# Altium project VEX Spin Up.PrjPcb
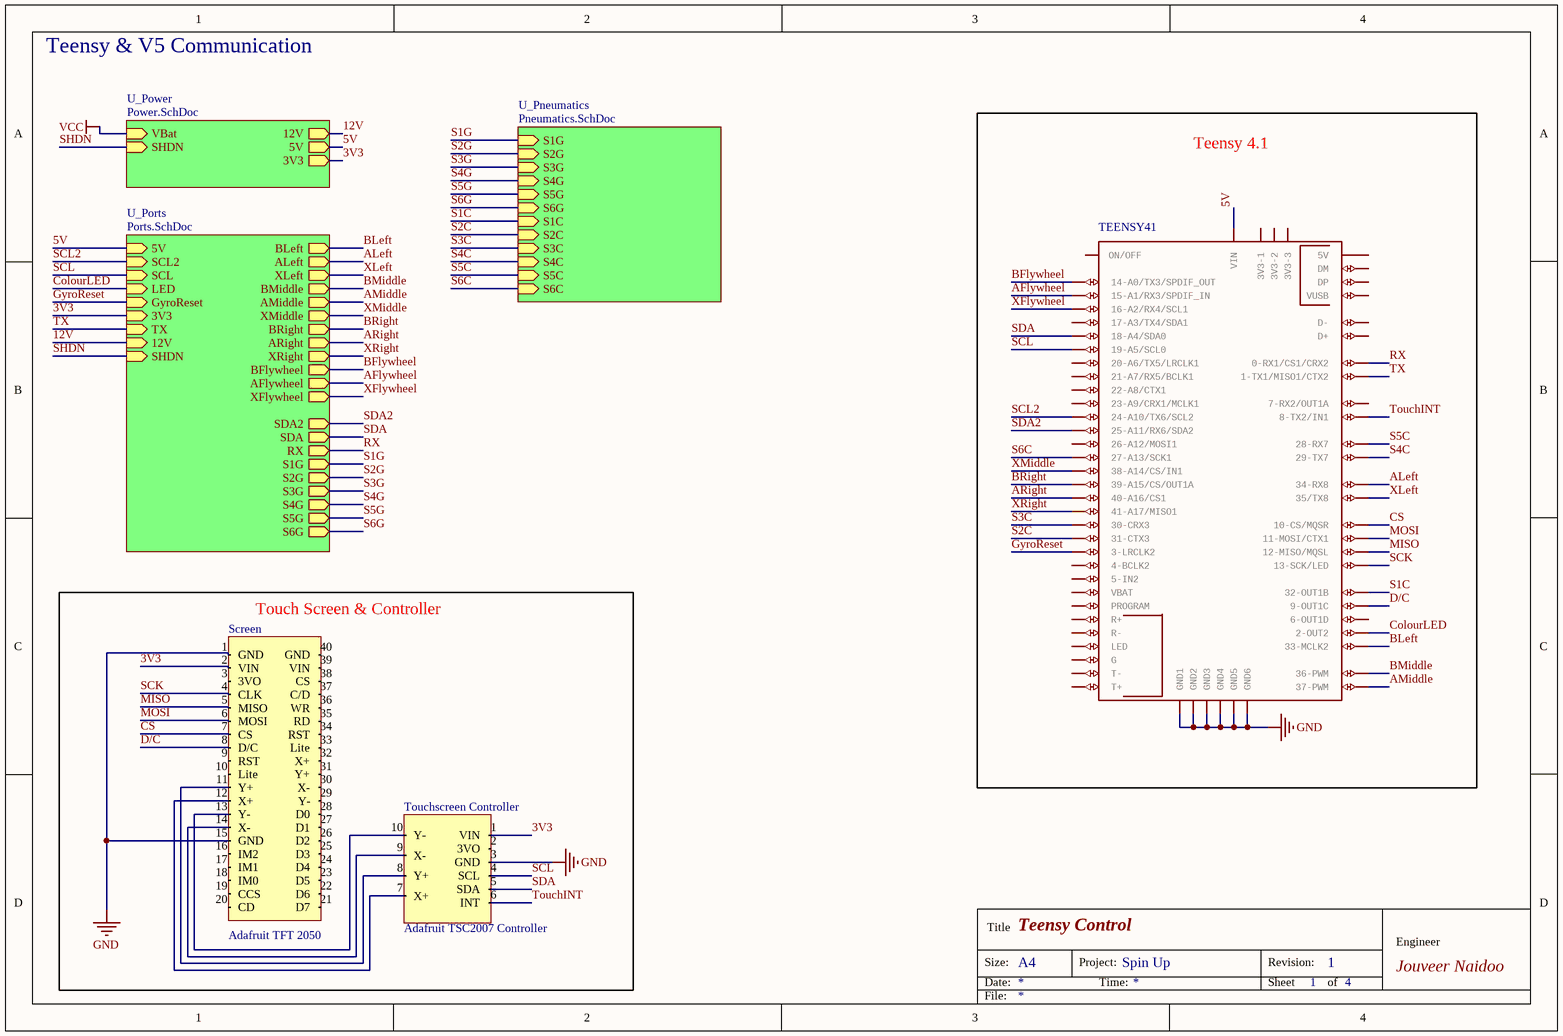
[diagram p0: Teensy Brain Control.SchDoc]
Engineer: Jouveer Naidoo; ProjectIdentifier: Spin Up
4 sheets, 82 parts. Net scope: hierarchical (ports join the sheet entries above them; power ports are global).
Board file: TeensyBrain.PcbDoc
Sheets:
  Teensy Brain Control.SchDoc
    U_Pneumatics = Pneumatics.SchDoc
    U_Ports = Ports.SchDoc
    U_Power = Power.SchDoc

## Sheet Teensy Brain Control.SchDoc: Teensy Control
size A4; Engineer: Jouveer Naidoo; DocumentNumber: 3; Revision: 1; SheetNumber: 1; SheetTotal: 4; ProjectIdentifier: Spin Up; SPICEModelCacheFPWZJBEA: <root> / <DocumentId>FPWZJBEA</DocumentId> / </root>

### Parts
Screen  Adafruit TFT 2050  [Adafruit TFT 2050-Footprint-1]
Teensy_4.1  TEENSY41  [TEENSY41]
Touchscreen_Controller  Adafruit TSC2007 Controller  [Adafruit TSC2007 Controller-Footprint-1]

### Blocks framed on the sheet
Teensy 4.1: Teensy_4.1
Touch Screen & Controller: Screen Touchscreen_Controller

### Sub-sheets
U_Pneumatics = Pneumatics.SchDoc: S1G (in), S2G (in), S3G (in), S4G (in), S5G (in), S1C (in), S2C (in), S3C (in), S4C (in), S5C (in), S6G (in), S6C (in)
U_Ports = Ports.SchDoc: 5V (in), BLeft (out), ALeft (out), XLeft (out), BMiddle (out), AMiddle (out), XMiddle (out), BRight (out), ARight (out), XRight (out), SCL (in), SDA (out), LED (in), GyroReset (in), 3V3 (in), TX (in), RX (out), 12V (in), S1G (out), S2G (out), S3G (out), S4G (out), S5G (out), S6G (out), BFlywheel (out), AFlywheel (out), XFlywheel (out), SHDN (in), SCL2 (in), SDA2 (out)
U_Power = Power.SchDoc: 12V (out), 5V (out), VBat (in), SHDN (in), 3V3 (out)

### Nets
GND: Screen.1(GND) Screen.15(GND) Teensy_4.1.GND1 Teensy_4.1.GND2 Teensy_4.1.GND3 Teensy_4.1.GND4 Teensy_4.1.GND5 Teensy_4.1.GND6 Touchscreen_Controller.3(GND)
3V3: Screen.2(VIN) Touchscreen_Controller.1(VIN) ; sheet U_Ports/3V3, sheet U_Power/3V3
5V: Teensy_4.1.VIN ; sheet U_Ports/5V, sheet U_Power/5V
12V: sheet U_Ports/12V, sheet U_Power/12V
AFlywheel: Teensy_4.1.15-A1/RX3/SPDIF_IN ; sheet U_Ports/AFlywheel
ALeft: Teensy_4.1.34-RX8 ; sheet U_Ports/ALeft
AMiddle: Teensy_4.1.37-PWM ; sheet U_Ports/AMiddle
ARight: Teensy_4.1.40-A16/CS1 ; sheet U_Ports/ARight
BFlywheel: Teensy_4.1.14-A0/TX3/SPDIF_OUT ; sheet U_Ports/BFlywheel
BLeft: Teensy_4.1.33-MCLK2 ; sheet U_Ports/BLeft
BMiddle: Teensy_4.1.36-PWM ; sheet U_Ports/BMiddle
BRight: Teensy_4.1.39-A15/CS/OUT1A ; sheet U_Ports/BRight
ColourLED: Teensy_4.1.2-OUT2 ; sheet U_Ports/LED
CS: Screen.7(CS) Teensy_4.1.10-CS\MQSR(10-CS/MQSR)
D/C: Screen.8(D/C) Teensy_4.1.9-OUT1C
GyroReset: Teensy_4.1.3-LRCLK2 ; sheet U_Ports/GyroReset
MISO: Screen.5(MISO) Teensy_4.1.12-MISO/MQSL
MOSI: Screen.6(MOSI) Teensy_4.1.11-MOSI/CTX1
RX: Teensy_4.1.0-RX1/CS1/CRX2 ; sheet U_Ports/RX
S1C: Teensy_4.1.32-OUT1B ; sheet U_Pneumatics/S1C
S1G: sheet U_Pneumatics/S1G, sheet U_Ports/S1G
S2C: Teensy_4.1.31-CTX3 ; sheet U_Pneumatics/S2C
S2G: sheet U_Pneumatics/S2G, sheet U_Ports/S2G
S3C: Teensy_4.1.30-CRX3 ; sheet U_Pneumatics/S3C
S3G: sheet U_Pneumatics/S3G, sheet U_Ports/S3G
S4C: Teensy_4.1.29-TX7 ; sheet U_Pneumatics/S4C
S4G: sheet U_Pneumatics/S4G, sheet U_Ports/S4G
S5C: Teensy_4.1.28-RX7 ; sheet U_Pneumatics/S5C
S5G: sheet U_Pneumatics/S5G, sheet U_Ports/S5G
S6C: Teensy_4.1.27-A13/SCK1 ; sheet U_Pneumatics/S6C
S6G: sheet U_Pneumatics/S6G, sheet U_Ports/S6G
SCK: Screen.4(CLK) Teensy_4.1.13-SCK/LED
SCL: Teensy_4.1.19-A5/SCL0 Touchscreen_Controller.4(SCL) ; sheet U_Ports/SCL
SCL2: Teensy_4.1.24-A10/TX6/SCL2 ; sheet U_Ports/SCL2
SDA: Teensy_4.1.18-A4/SDA0 Touchscreen_Controller.5(SDA) ; sheet U_Ports/SDA
SDA2: Teensy_4.1.25-A11/RX6/SDA2 ; sheet U_Ports/SDA2
SHDN: sheet U_Ports/SHDN, sheet U_Power/SHDN
TouchINT: Teensy_4.1.8-TX2/IN1 Touchscreen_Controller.6(INT)
TX: Teensy_4.1.1-TX1/MISO1/CTX2 ; sheet U_Ports/TX
XFlywheel: Teensy_4.1.16-A2/RX4/SCL1 ; sheet U_Ports/XFlywheel
XLeft: Teensy_4.1.35-TX8(35/TX8) ; sheet U_Ports/XLeft
XMiddle: Teensy_4.1.38-A14/CS/IN1 ; sheet U_Ports/XMiddle
XRight: Teensy_4.1.41-A17/MISO1 ; sheet U_Ports/XRight
NetScreen_11: Screen.11(Y+) Touchscreen_Controller.8(Y+)
NetScreen_12: Screen.12(X+) Touchscreen_Controller.7(X+)
NetScreen_13: Screen.13(Y-) Touchscreen_Controller.10(Y-)
NetScreen_14: Screen.14(X-) Touchscreen_Controller.9(X-)

Not connected (* = marked no-connect by the designer): Screen 3(3VO) 9(RST) 10(Lite) 16(IM2) 17(IM1) 18(IM0) 19(CCS) 20(CD) 21(D7) 22(D6) 23(D5) 24(D4) 25(D3) 26(D2) 27(D1) 28(D0) 29(Y-) 30(X-) 31(Y+) 32(X+) 33(Lite) 34(RST) 35(RD) 36(WR) 37(C/D) 38(CS) 39(VIN) 40(GND); Teensy_4.1 3V3-1 3V3-2 3V3-3 4-BCLK2 5-IN2 6-OUT1D 7-RX2/OUT1A 17-A3/TX4/SDA1 20-A6/TX5/LRCLK1 21-A7/RX5/BCLK1 22-A8/CTX1 23-A9/CRX1/MCLK1 26-A12/MOSI1 +5V(5V) D+ D- DM DP G LED ON/OFF PROGRAM R+ R- T+ T- VBAT VUSB; Touchscreen_Controller 2(3VO)

### Notes on the sheet
- Teensy & V5 Communication
- Size:
- Date:
- Title
- A4
- Project:
- Time:
- Revision:
- Sheet
- of
- Engineer
- File:

### Library data of the parts
Screen = CMP-001-0000-2
Teensy_4.1 = CMP-013-000002-2: Teensy 4.1 Development Board; GateName_1: G$1; Evaluation Kit: Yes; Core Architecture: ARM; DeviceSetName: TEENSY41; Design Item ID: TEENSY41; Source: teensy.SCHLIB; SymbolName_1: TEENSY41; LibraryName: teensy; Package: TEENSY41; Series: i.MX
Touchscreen_Controller = CMP-015-00009-3

## Sheet Pneumatics.SchDoc: Solenoid Drivers
size A4; DocumentNumber: 1; Revision: 1; SheetNumber: 2; SheetTotal: 5
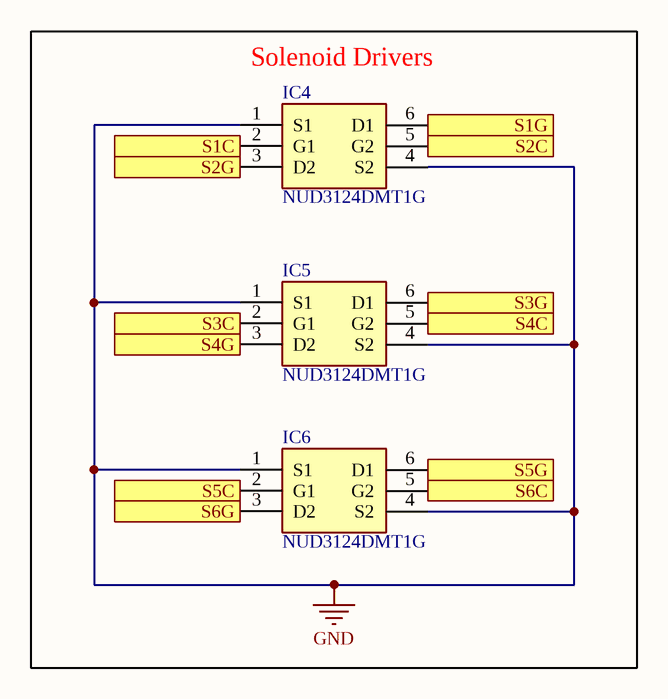
[diagram p1: Pneumatics.SchDoc]

### Parts
IC4  NUD3124DMT1G  [SOT95P275X110-6N]
IC5  NUD3124DMT1G  [SOT95P275X110-6N]
IC6  NUD3124DMT1G  [SOT95P275X110-6N]

### Blocks framed on the sheet
Solenoid Drivers: IC4-IC6

### Ports
S1C (in), S1G (in), S2C (in), S2G (in), S3C (in), S3G (in), S4C (in), S4G (in), S5C (in), S5G (in), S6C (in), S6G (in)

### Nets
GND: IC4.1(S1) IC4.4(S2) IC5.1(S1) IC5.4(S2) IC6.1(S1) IC6.4(S2)
S1C: IC4.2(G1) ; port S1C
S1G: IC4.6(D1) ; port S1G
S2C: IC4.5(G2) ; port S2C
S2G: IC4.3(D2) ; port S2G
S3C: IC5.2(G1) ; port S3C
S3G: IC5.6(D1) ; port S3G
S4C: IC5.5(G2) ; port S4C
S4G: IC5.3(D2) ; port S4G
S5C: IC6.2(G1) ; port S5C
S5G: IC6.6(D1) ; port S5G
S6C: IC6.5(G2) ; port S6C
S6G: IC6.3(D2) ; port S6G

### Notes on the sheet
- Size:
- Date:
- Title
- A4
- Project:
- Time:
- Revision:
- Sheet
- of
- Engineer
- File:

### Library data of the parts
IC4-IC6 = NUD3124DMT1G: Integrated Circuit; Manufacturer_Name: onsemi; Datasheet Link: http://www.onsemi.com/pub/Collateral/NUD3124-D.PDF; Height: 1.1mm; Manufacturer_Part_Number: NUD3124DMT1G; Mouser Part Number: 863-NUD3124DMT1G; Mouser Price/Stock: https://www.mouser.co.uk/ProductDetail/onsemi/NUD3124DMT1G?qs=ZXBb0xZ9WeDtXMbpPTBW4g%3D%3D; Arrow Part Number: NUD3124DMT1G; Arrow Price/Stock: https://www.arrow.com/en/products/nud3124dmt1g/on-semiconductor?region=nac

## Sheet Ports.SchDoc: External Ports
size A4; Engineer: Jouveer Naidoo; DocumentNumber: 2; Revision: 1; SheetNumber: 3; SheetTotal: 4; ProjectIdentifier: Spin Up
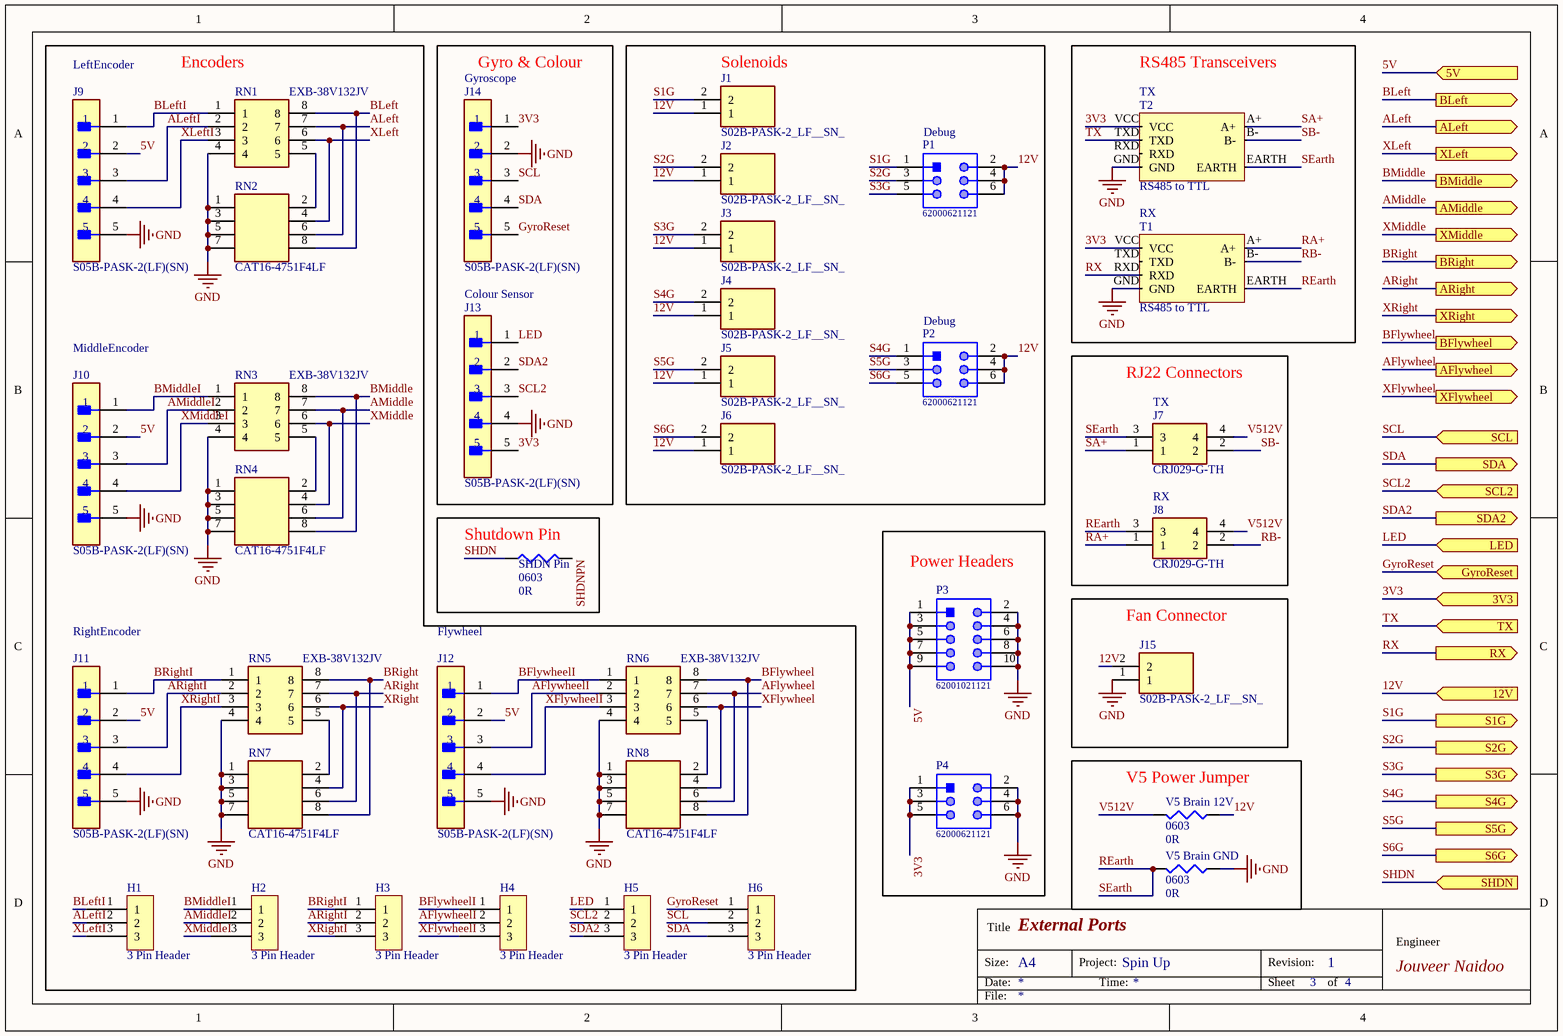
[diagram p2: Ports.SchDoc]

### Parts
H1  3 Pin Header  [3 Pin Header-Footprint-1]
H2  3 Pin Header  [3 Pin Header-Footprint-1]
H3  3 Pin Header  [3 Pin Header-Footprint-1]
H4  3 Pin Header  [3 Pin Header-Footprint-1]
H5  3 Pin Header  [3 Pin Header-Footprint-1]
H6  3 Pin Header  [3 Pin Header-Footprint-1]
J1  S02B-PASK-2_LF__SN_  [S02BPASK2LFSN]
J2  S02B-PASK-2_LF__SN_  [S02BPASK2LFSN]
J3  S02B-PASK-2_LF__SN_  [S02BPASK2LFSN]
J4  S02B-PASK-2_LF__SN_  [S02BPASK2LFSN]
J5  S02B-PASK-2_LF__SN_  [S02BPASK2LFSN]
J6  S02B-PASK-2_LF__SN_  [S02BPASK2LFSN]
J7  CRJ029-G-TH  [CRJ029GTH]
J8  CRJ029-G-TH  [CRJ029GTH]
J9  S05B-PASK-2(LF)(SN)  [FP-S05B-PASK-2_LF_SN-MFG]
J10  S05B-PASK-2(LF)(SN)  [FP-S05B-PASK-2_LF_SN-MFG]
J11  S05B-PASK-2(LF)(SN)  [FP-S05B-PASK-2_LF_SN-MFG]
J12  S05B-PASK-2(LF)(SN)  [FP-S05B-PASK-2_LF_SN-MFG]
J13  S05B-PASK-2(LF)(SN)  [FP-S05B-PASK-2_LF_SN-MFG]
J14  S05B-PASK-2(LF)(SN)  [FP-S05B-PASK-2_LF_SN-MFG]
J15  S02B-PASK-2_LF__SN_  [S02BPASK2LFSN]
P1  62000621121  [62000621121]
P2  62000621121  [62000621121]
P3  62001021121  [62001021121]
P4  62000621121  [62000621121]
RN1  EXB-38V132JV  [EXB38V132JV]
RN2  CAT16-4751F4LF  [CAPCAV80P155X320X60-8L]
RN3  EXB-38V132JV  [EXB38V132JV]
RN4  CAT16-4751F4LF  [CAPCAV80P155X320X60-8L]
RN5  EXB-38V132JV  [EXB38V132JV]
RN6  EXB-38V132JV  [EXB38V132JV]
RN7  CAT16-4751F4LF  [CAPCAV80P155X320X60-8L]
RN8  CAT16-4751F4LF  [CAPCAV80P155X320X60-8L]
SHDN_Pin  0603  value 0R  [J1-0603]
T1  RS485 to TTL  [RS485 to TTL-Footprint-1]
T2  RS485 to TTL  [RS485 to TTL-Footprint-1]
V5_Brain_12V  0603  value 0R  [J1-0603]
V5_Brain_GND  0603  value 0R  [J1-0603]

### Blocks framed on the sheet
Encoders: H1-H6 J9-J12 RN1-RN8
Gyro & Colour: J13 J14
Solenoids: J1-J6 P1 P2
RS485 Transceivers: T1 T2
RJ22 Connectors: J7 J8
Shutdown Pin: SHDN_Pin
Power Headers: P3 P4
Fan Connector: J15
V5 Power Jumper: V5_Brain_12V V5_Brain_GND

### Ports
3V3 (in), 5V (in), 12V (in), AFlywheel (out), ALeft (out), AMiddle (out), ARight (out), BFlywheel (out), BLeft (out), BMiddle (out), BRight (out), GyroReset (in), LED (in), RX (out), S1G (out), S2G (out), S3G (out), S4G (out), S5G (out), S6G (out), SCL2 (in), SCL (in), SDA2 (out), SDA (out), SHDN (in), TX (in), XFlywheel (out), XLeft (out), XMiddle (out), XRight (out)

### Nets
GND: J9.5 J10.5 J11.5 J12.5 J13.4 J14.2 J15.1 P3.2 P3.4 P3.6 P3.8 P3.10 P4.2 P4.4 P4.6 RN1.4 RN2.1 RN2.3 RN2.5 RN2.7 RN3.4 RN4.1 RN4.3 RN4.5 RN4.7 RN5.4 RN6.4 RN7.1 RN7.3 RN7.5 RN7.7 RN8.1 RN8.3 RN8.5 RN8.7 T1.GND T2.GND V5_Brain_GND.1
3V3: J13.5 J14.1 P4.1 P4.3 P4.5 T1.VCC T2.VCC ; port 3V3
5V: J9.2 J10.2 J11.2 J12.2 P3.1 P3.3 P3.5 P3.7 P3.9 ; port 5V
12V: J1.1 J2.1 J3.1 J4.1 J5.1 J6.1 J15.2 P1.2 P1.4 P1.6 P2.2 P2.4 P2.6 V5_Brain_12V.1 ; port 12V
AFlywheel: RN6.7 RN8.6 ; port AFlywheel
AFlywheelI: H4.2 J12.3 RN6.2
ALeft: RN1.7 RN2.6 ; port ALeft
ALeftI: H1.2 J9.3 RN1.2
AMiddle: RN3.7 RN4.6 ; port AMiddle
AMiddleI: H2.2 J10.3 RN3.2
ARight: RN5.7 RN7.6 ; port ARight
ARightI: H3.2 J11.3 RN5.2
BFlywheel: RN6.8 RN8.8 ; port BFlywheel
BFlywheelI: H4.1 J12.1 RN6.1
BLeft: RN1.8 RN2.8 ; port BLeft
BLeftI: H1.1 J9.1 RN1.1
BMiddle: RN3.8 RN4.8 ; port BMiddle
BMiddleI: H2.1 J10.1 RN3.1
BRight: RN5.8 RN7.8 ; port BRight
BRightI: H3.1 J11.1 RN5.1
GyroReset: H6.1 J14.5 ; port GyroReset
LED: H5.1 J13.1 ; port LED  [project net ColourLED]
RA+: J8.1 T1.A+
RB-: J8.2 T1.B-
REarth: J7.3 J8.3 T1.EARTH T2.EARTH V5_Brain_GND.2  [also labelled SEarth]
RX: T1.RXD ; port RX
S1G: J1.2 P1.1 ; port S1G
S2G: J2.2 P1.3 ; port S2G
S3G: J3.2 P1.5 ; port S3G
S4G: J4.2 P2.1 ; port S4G
S5G: J5.2 P2.3 ; port S5G
S6G: J6.2 P2.5 ; port S6G
SA+: J7.1 T2.A+
SB-: J7.2 T2.B-
SCL: H6.2 J14.3 ; port SCL
SCL2: H5.2 J13.3 ; port SCL2
SDA: H6.3 J14.4 ; port SDA
SDA2: H5.3 J13.2 ; port SDA2
SHDN: SHDN_Pin.1 ; port SHDN
SHDNPN: SHDN_Pin.2
TX: T2.TXD ; port TX
V512V: J7.4 J8.4 V5_Brain_12V.2
XFlywheel: RN6.6 RN8.4 ; port XFlywheel
XFlywheelI: H4.3 J12.4 RN6.3
XLeft: RN1.6 RN2.4 ; port XLeft
XLeftI: H1.3 J9.4 RN1.3
XMiddle: RN3.6 RN4.4 ; port XMiddle
XMiddleI: H2.3 J10.4 RN3.3
XRight: RN5.6 RN7.4 ; port XRight
XRightI: H3.3 J11.4 RN5.3
NetRN1_5: RN1.5 RN2.2
NetRN3_5: RN3.5 RN4.2
NetRN5_5: RN5.5 RN7.2
NetRN6_5: RN6.5 RN8.2

Not connected (* = marked no-connect by the designer): T1 TXD; T2 RXD

### Notes on the sheet
- LeftEncoder
- (near J14) Gyroscope
- (near T2) TX
- (near P1) Debug
- RX
- Colour Sensor
- MiddleEncoder
- (near P2) Debug
- (near J7) TX
- RightEncoder
- Flywheel
- Size:
- Date:
- Title
- A4
- Project:
- Time:
- Revision:
- Sheet
- of
- Engineer
- File:

### Library data of the parts
H1-H6 = CMP-002-00071-1
J1-J6 J15 = S02B-PASK-2_LF__SN_: Connector; Manufacturer_Name: JST (JAPAN SOLDERLESS TERMINALS); Manufacturer_Part_Number: S02B-PASK-2(LF)(SN); Datasheet Link: http://www.jst-mfg.com/product/pdf/eng/ePA-F.pdf; Height: 6.5mm; Arrow Part Number: S02B-PASK-2(LF)(SN); Arrow Price/Stock: https://www.arrow.com/en/products/s02b-pask-2-lf-sn/jst-manufacturing?region=europe; System: Connector
J7 J8 = CRJ029-G-TH: Connector; Manufacturer_Name: CUI Inc.; Datasheet Link: https://www.cuidevices.com/product/resource/crj029-g-th.pdf; Height: 14.75mm; Manufacturer_Part_Number: CRJ029-G-TH; Mouser Part Number: 490-CRJ029-G-TH; Mouser Price/Stock: https://www.mouser.co.uk/ProductDetail/CUI-Devices/CRJ029-G-TH?qs=iLbezkQI%252Bsg4hjAOAa4IsA%3D%3D; System: Connector
J9-J14 = CMP-17439-000393-1: CONN HEADER R/A 5POS 2MM; Current Rating: 3A; Voltage Rating: 250V; Number of Contacts: 5; System: Connector; Contact Shape: Square; Orientation: Right Angle; Mount: Through Hole; Fastening Type: Ramp; Contact Material: Copper Alloy; Insulation Material: PBT; Insulation Color: Natural; Contact Type: Male Pin; Flammability Rating: UL94 V-0; Contact Plating: Tin; Connector Type: Header; Number of Positions: 5; Contact Finish - Mating: TIN; Housing Color: White; Color: Natural; Termination: Solder; Series: PA; Lead Free: Lead Free; Pitch: 2mm; Number of Rows: 1; Package Quantity: 500; Packaging: Bulk
P1 P2 P4 = CMP-1502-00961-1: THT Vertical Pin Header WR-PHD, Pitch 2.00 mm, Dual Row, 6 pins; Manufacturer: Wurth Elektronik; Gender: Male; Withstanding Voltage: 500VAC; Pin Number: 6; Pitch: 2.00mm; Rated Current: 2A; Contact Resistance: 20mOhm; Working Voltage: 200VAC; Package Reference: 62000621121; Row Number: Dual; Publisher: WurthElektronik; Manufacturer URL: http://www.we-online.de; Part Number: 62000621121; Operating Temperature: -40to105degC; Mounting Technology: THT; Orientation: Vertical; Packaging: Bag; Datasheet URL: https://katalog.we-online.de/em/datasheet/62000621121.pdf
P3 = CMP-1502-00965-1: THT Vertical Pin Header WR-PHD, Pitch 2.00 mm, Dual Row, 10 pins; Manufacturer: Wurth Elektronik; Contact Resistance: 20mOhm; Withstanding Voltage: 500VAC; Gender: Male; Pitch: 2.00mm; Working Voltage: 200VAC; Rated Current: 2A; Pin Number: 10; Row Number: Dual; Orientation: Vertical; Part Number: 62001021121; Manufacturer URL: http://www.we-online.de; Operating Temperature: -40to105degC; Datasheet URL: https://katalog.we-online.de/em/datasheet/62001021121.pdf; Publisher: WurthElektronik; Package Reference: 62001021121; Mounting Technology: THT; Packaging: Bag
RN1 RN3 RN5 RN6 = EXB-38V132JV: Resistor Network; Manufacturer_Name: Panasonic; Datasheet Link: https://industrial.panasonic.com/cdbs/www-data/pdf/AOC0000/AOC0000C14.pdf; Height: 0.6mm; Manufacturer_Part_Number: EXB-38V132JV; Mouser Part Number: 667-EXB-38V132JV; Mouser Price/Stock: https://www.mouser.co.uk/ProductDetail/Panasonic/EXB-38V132JV?qs=WwqriLBepZuuySSdwYXZFg%3D%3D
RN2 RN4 RN7 RN8 = CAT16-4751F4LF: Resistor Network; Manufacturer_Name: Bourns; Datasheet Link: http://www.bourns.com/docs/Product-Datasheets/cat16-j.pdf; Height: 0.6mm; Manufacturer_Part_Number: CAT16-4751F4LF; Mouser Part Number: 652-CAT16-4751F4LF; Mouser Price/Stock: https://www.mouser.co.uk/ProductDetail/Bourns/CAT16-4751F4LF?qs=vP03yYafZdFfyS1KGGbPOQ%3D%3D
SHDN_Pin V5_Brain_12V V5_Brain_GND = Res3: Resistor; Published: 8-Jun-2000; LatestRevisionDate: 29-May-2009; LatestRevisionNote: IPC-7351 Footprint Added.; PackageReference: J1-0603; Publisher: Altium Limited; PackageDescription: Chip Resistor
T1 T2 = CMP-015-00008-4: RS485 to TTL Converter

## Sheet Power.SchDoc: Power Delivery
size A4; Engineer: Jouveer Naidoo; DocumentNumber: 4; Revision: 1; SheetNumber: 4; SheetTotal: 4; SPICEModelCacheIVYGDNUI: <root> / <DocumentId>IVYGDNUI</DocumentId> / <CacheFrame Number="0"> / <Model Name="cap" Kind="MDL"> / <Text>*Default semiconductor capacitor / .MODEL CAP C()</Text> / </Model> / </CacheFrame> / </root>; ProjectIdentifier: Spin Up
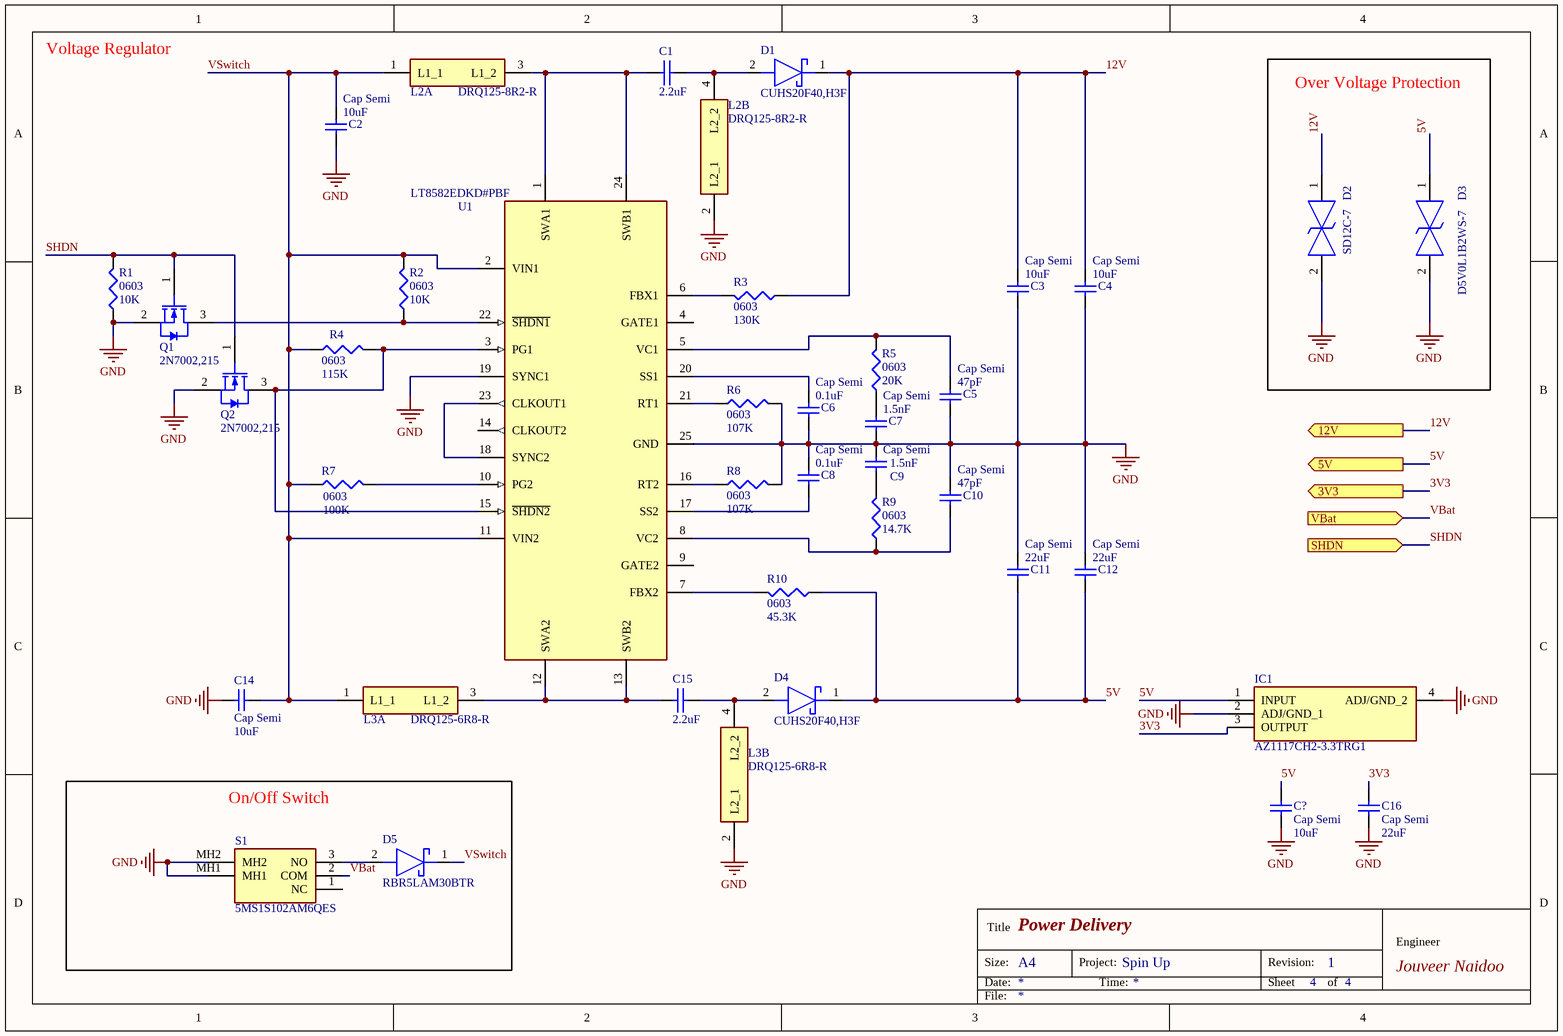
[diagram p3: Power.SchDoc]

### Parts
C1  value 2.2uF  [0805 CAP]  (hidden comment: CerCap_SMT_0805)
C2  Cap Semi  value 10uF  [C1210]
C3  Cap Semi  value 10uF  [C1210]
C4  Cap Semi  value 10uF  [C1210]
C5  Cap Semi  value 47pF  [1608[0603]]
C6  Cap Semi  value 0.1uF  [1608[0603]]
C7  Cap Semi  value 1.5nF  [1608[0603]]
C8  Cap Semi  value 0.1uF  [1608[0603]]
C9  Cap Semi  value 1.5nF  [1608[0603]]
C10  Cap Semi  value 47pF  [1608[0603]]
C11  Cap Semi  value 22uF  [C1210]
C12  Cap Semi  value 22uF  [C1210]
C14  Cap Semi  value 10uF  [C1210]
C15  value 2.2uF  [0805 CAP]  (hidden comment: CerCap_SMT_0805)
C16  Cap Semi  value 22uF  [C1210]
C?  Cap Semi  value 10uF  [C1210]
D1  CUHS20F40,H3F  [CUHS20F40H3F]
D2  SD12C-7  [SD12C7]
D3  D5V0L1B2WS-7  [D5V0L1B2WS7]
D4  CUHS20F40,H3F  [CUHS20F40H3F]
D5  RBR5LAM30BTR  [SODFL4725X105N]
IC1  AZ1117CH2-3.3TRG1  [SOT230P700X180-4N]
L2  DRQ125-8R2-R  [DRQ125-8R2-R-Footprint-1]  (parts A,B of 2)
L3  DRQ125-6R8-R  [DRQ125-6R8-R-Footprint-1]  (parts A,B of 2)
Q1  2N7002,215  [NXP-SOT23-3_V]
Q2  2N7002,215  [NXP-SOT23-3_V]
R1  0603  value 10K  [J1-0603]
R2  0603  value 10K  [J1-0603]
R3  0603  value 130K  [J1-0603]
R4  0603  value 115K  [J1-0603]
R5  0603  value 20K  [J1-0603]
R6  0603  value 107K  [J1-0603]
R7  0603  value 100K  [J1-0603]
R8  0603  value 107K  [J1-0603]
R9  0603  value 14.7K  [J1-0603]
R10  0603  value 45.3K  [J1-0603]
S1  5MS1S102AM6QES  [5MS1S102AM6QES]
U1  LT8582EDKD#PBF  [FP-DKD-24-05-08-1864-MFG]

### Blocks framed on the sheet
Over Voltage Protection: D2 D3
On/Off Switch: D5 S1

### Ports
3V3 (out), 5V (out), 12V (out), SHDN (in), VBat (in)

### Nets
GND: C2.1 C3.1 C4.1 C5.1 C6.1 C7.1 C8.2 C9.2 C10.2 C11.2 C12.2 C14.1 C16.2 C?.1 D2.2 D3.2 IC1.2(ADJ/GND_1) IC1.4(ADJ/GND_2) L2.2(L2_1) L3.2(L2_1) Q1.2(S) Q2.2(S) R1.1 R6.2 R8.2 S1.MH1 S1.MH2 U1.19(SYNC1) U1.25(GND)
VBat: S1.2(COM) ; port VBat
3V3: C16.1 IC1.3(OUTPUT) ; port 3V3
5V: C11.1 C12.1 C?.2 D3.1 D4.1(K) IC1.1(INPUT) R10.1 ; port 5V
12V: C3.2 C4.2 D1.1(K) D2.1 R3.1 ; port 12V
SHDN: Q1.1(G) Q2.1(G) R1.2 ; port SHDN
VSwitch: C2.2 C14.2 D5.1(K) L2.1(L1_1) L3.1(L1_1) R2.2 R4.1 R7.1 U1.2(VIN1) U1.11(VIN2)
NetC1_1: C1.1 L2.3(L1_2) U1.1(SWA1) U1.24(SWB1)
NetC1_2: C1.2 D1.2(A) L2.4(L2_2)
NetC5_2: C5.2 R5.2 U1.5(VC1)
NetC6_2: C6.2 U1.20(SS1)
NetC7_2: C7.2 R5.1
NetC8_1: C8.1 U1.17(SS2)
NetC9_1: C9.1 R9.2
NetC10_1: C10.1 R9.1 U1.8(VC2)
NetC15_1: C15.1 L3.3(L1_2) U1.12(SWA2) U1.13(SWB2)
NetC15_2: C15.2 D4.2(A) L3.4(L2_2)
NetD5_2: D5.2(A) S1.3(NO)
NetQ1_3: Q1.3(D) R2.1 U1.22(~{SHDN1})
NetQ2_3: Q2.3(D) R4.2 U1.3(PG1) U1.15(~{SHDN2})
NetR3_2: R3.2 U1.6(FBX1)
NetR6_1: R6.1 U1.21(RT1)
NetR7_2: R7.2 U1.10(PG2)
NetR8_1: R8.1 U1.16(RT2)
NetR10_2: R10.2 U1.7(FBX2)
NetU1_18: U1.18(SYNC2) U1.23(CLKOUT1)

Not connected (* = marked no-connect by the designer): S1 1(NC); U1 4(GATE1) 9(GATE2) 14(CLKOUT2)

### Notes on the sheet
- Voltage Regulator
- Size:
- Date:
- Title
- A4
- Project:
- Time:
- Revision:
- Sheet
- of
- Engineer
- File:

### Library data of the parts
C1 C15 = CMP-003-000000-1: SMT ceramic capacitor 0805 size; Pin Count: 2; Design Item ID: CerCap_SMT_0805; Component Type: Standard; Source: EE209_SchLib.SchLib
C2-C12 C14 C16 C? = Cap Semi: Capacitor (Semiconductor SIM Model); Published: 8-Jun-2000; LatestRevisionDate: 29-May-2009; LatestRevisionNote: IPC-7351 Footprint Added.; PackageReference: C1206; Publisher: Altium Limited; PackageDescription: Chip Capacitor
D1 D4 = CUHS20F40,H3F: Schottky Diode; Manufacturer_Name: Toshiba; Datasheet Link: https://componentsearchengine.com/Datasheets/1/CUHS20F40,H3F.pdf; Manufacturer_Part_Number: CUHS20F40,H3F; Mouser Part Number: 757-CUHS20F40H3F; Mouser Price/Stock: https://www.mouser.co.uk/ProductDetail/Toshiba/CUHS20F40H3F?qs=PqoDHHvF64%252B%2F27NPskrW9Q%3D%3D
D2 = SD12C-7: TVS Diode (Bi-directional); Manufacturer_Name: Diodes Inc.; Datasheet Link: https://www.diodes.com/assets/Datasheets/SD12C.pdf; Height: 1.2mm; Manufacturer_Part_Number: SD12C-7; Mouser Part Number: 621-SD12C-7; Mouser Price/Stock: https://www.mouser.co.uk/ProductDetail/Diodes-Incorporated/SD12C-7?qs=EBDBlbfErPxugjAb5VaoMA%3D%3D; Arrow Part Number: SD12C-7; Arrow Price/Stock: https://www.arrow.com/en/products/sd12c-7/diodes-incorporated?region=nac
D3 = D5V0L1B2WS-7: TVS Diode (Bi-directional); Manufacturer_Name: Diodes Inc.; Datasheet Link: https://www.diodes.com/assets/Datasheets/D5V0L1B2WS.pdf; Height: 1.2mm; Manufacturer_Part_Number: D5V0L1B2WS-7; Mouser Part Number: 621-D5V0L1B2WS-7; Mouser Price/Stock: https://www.mouser.co.uk/ProductDetail/Diodes-Incorporated/D5V0L1B2WS-7?qs=gfe7vQ8txpVauHZXjiZDzg%3D%3D; Arrow Part Number: D5V0L1B2WS-7; Arrow Price/Stock: https://www.arrow.com/en/products/d5v0l1b2ws-7/diodes-incorporated?region=nac
D5 = RBR5LAM30BTR: Schottky Diode; Manufacturer_Name: ROHM Semiconductor; Datasheet Link: https://fscdn.rohm.com/en/products/databook/datasheet/discrete/diode/schottky_barrier/rbr5lam30btr-e.pdf; Height: 1.05mm; Manufacturer_Part_Number: RBR5LAM30BTR; Mouser Part Number: 755-RBR5LAM30BTR; Mouser Price/Stock: https://www.mouser.co.uk/ProductDetail/ROHM-Semiconductor/RBR5LAM30BTR?qs=4v%252BiZTmLVHGtLozrhLHugw%3D%3D
IC1 = AZ1117CH2-3.3TRG1: Integrated Circuit; Manufacturer_Name: Diodes Inc.; Datasheet Link: https://www.arrow.com/en/products/az1117ch2-3.3trg1/diodes-incorporated; Height: 1.8mm; Manufacturer_Part_Number: AZ1117CH2-3.3TRG1; Mouser Part Number: 621-AZ1117CH2-33TRG1; Mouser Price/Stock: https://www.mouser.co.uk/ProductDetail/Diodes-Incorporated/AZ1117CH2-3.3TRG1?qs=lQAVKuKFhkLc7jCxso2G3w%3D%3D; Arrow Part Number: AZ1117CH2-3.3TRG1; Arrow Price/Stock: https://www.arrow.com/en/products/az1117ch2-3.3trg1/diodes-incorporated?region=nac
L2 = CMP-006-00021-2: Ind Power Shielded Wirewound 8.048uH/32.19uH 20% 100KHz Ferrite 5.54A/2.77A T/R
L3 = CMP-006-00023-1: Ind Power Shielded Wirewound 6.588uH/26.35uH 20% 100KHz Ferrite 6.64A/3.32A T/R
Q1 Q2 = CMP-013-00011-4: N-channel Trench MOSFET, 60 V, 300 mA, -65 to 150 degC, 3-Pin SOT-23 (TO-236AB), RoHS, Tape and Reel; Manufacturer: NXP Semiconductors; Elements: 1; Power: 830mW; Max Dual Supply Voltage: 60V; Rds On Max: 5Ohm; Package Version: Feb-16; Nominal Vgs: 2V; Input Capacitance: 50pF; RoHS Compliant: True; Datasheet URL: http://www.nxp.com/documents/data_sheet/2N7002.pdf; Packaging: TapeandReel; Case/Package: TO-236-3; Package Reference: SOT23-3; Max Operating Temperature: 150°C; Pins: 8; Mounting Technology: SM; Package Quantity: 1; Datasheet Version: Rev. 7, 09/2011; Nominal Dual Supply Voltage: 60V; Min Operating Temperature: -65°C; Package Description: 3-Pin Small Outline Transistor, Body 1.3 x 2.9 mm, Pitch 0.95 mm; Vds Max: 60V
R1-R10 = Res3: Resistor; Published: 8-Jun-2000; LatestRevisionDate: 29-May-2009; LatestRevisionNote: IPC-7351 Footprint Added.; PackageReference: J1-0603; Publisher: Altium Limited; PackageDescription: Chip Resistor
S1 = 5MS1S102AM6QES: Switch; Manufacturer_Name: Dailywell; Datasheet Link: https://cz.mouser.com/datasheet/2/979/Dailywell_01132020_5M_Series-1708766.pdf; Height: 6.6mm; Manufacturer_Part_Number: 5MS1S102AM6QES; Mouser Part Number: 118-5MS1S102AM6QES; Mouser Price/Stock: https://www.mouser.co.uk/ProductDetail/Dailywell/5MS1S102AM6QES?qs=B6kkDfuK7%2FBHVJoQEkyphg%3D%3D
U1 = CMP-019-00050-5: IC REG MULT CONFIG INV ADJ 24DFN

## Nets that join several sheets
GND: Teensy Brain Control (9 pins), Pneumatics (6 pins), Ports (38 pins), Power (29 pins)
3V3: Teensy Brain Control (Screen.2 Touchscreen_Controller.1), Ports (7 pins), Power (C16.1 IC1.3)
5V: Teensy Brain Control (Teensy_4.1.VIN), Ports (9 pins), Power (7 pins)
12V: Ports (14 pins), Power (5 pins)
AFlywheel: Teensy Brain Control (Teensy_4.1.15-A1/RX3/SPDIF_IN), Ports (RN6.7 RN8.6)
ALeft: Teensy Brain Control (Teensy_4.1.34-RX8), Ports (RN1.7 RN2.6)
AMiddle: Teensy Brain Control (Teensy_4.1.37-PWM), Ports (RN3.7 RN4.6)
ARight: Teensy Brain Control (Teensy_4.1.40-A16/CS1), Ports (RN5.7 RN7.6)
BFlywheel: Teensy Brain Control (Teensy_4.1.14-A0/TX3/SPDIF_OUT), Ports (RN6.8 RN8.8)
BLeft: Teensy Brain Control (Teensy_4.1.33-MCLK2), Ports (RN1.8 RN2.8)
BMiddle: Teensy Brain Control (Teensy_4.1.36-PWM), Ports (RN3.8 RN4.8)
BRight: Teensy Brain Control (Teensy_4.1.39-A15/CS/OUT1A), Ports (RN5.8 RN7.8)
ColourLED: Teensy Brain Control (Teensy_4.1.2-OUT2), Ports (H5.1 J13.1)
GyroReset: Teensy Brain Control (Teensy_4.1.3-LRCLK2), Ports (H6.1 J14.5)
RX: Teensy Brain Control (Teensy_4.1.0-RX1/CS1/CRX2), Ports (T1.RXD)
S1C: Teensy Brain Control (Teensy_4.1.32-OUT1B), Pneumatics (IC4.2)
S1G: Pneumatics (IC4.6), Ports (J1.2 P1.1)
S2C: Teensy Brain Control (Teensy_4.1.31-CTX3), Pneumatics (IC4.5)
S2G: Pneumatics (IC4.3), Ports (J2.2 P1.3)
S3C: Teensy Brain Control (Teensy_4.1.30-CRX3), Pneumatics (IC5.2)
S3G: Pneumatics (IC5.6), Ports (J3.2 P1.5)
S4C: Teensy Brain Control (Teensy_4.1.29-TX7), Pneumatics (IC5.5)
S4G: Pneumatics (IC5.3), Ports (J4.2 P2.1)
S5C: Teensy Brain Control (Teensy_4.1.28-RX7), Pneumatics (IC6.2)
S5G: Pneumatics (IC6.6), Ports (J5.2 P2.3)
S6C: Teensy Brain Control (Teensy_4.1.27-A13/SCK1), Pneumatics (IC6.5)
S6G: Pneumatics (IC6.3), Ports (J6.2 P2.5)
SCL: Teensy Brain Control (Teensy_4.1.19-A5/SCL0 Touchscreen_Controller.4), Ports (H6.2 J14.3)
SCL2: Teensy Brain Control (Teensy_4.1.24-A10/TX6/SCL2), Ports (H5.2 J13.3)
SDA: Teensy Brain Control (Teensy_4.1.18-A4/SDA0 Touchscreen_Controller.5), Ports (H6.3 J14.4)
SDA2: Teensy Brain Control (Teensy_4.1.25-A11/RX6/SDA2), Ports (H5.3 J13.2)
SHDN: Ports (SHDN_Pin.1), Power (Q1.1 Q2.1 R1.2)
TX: Teensy Brain Control (Teensy_4.1.1-TX1/MISO1/CTX2), Ports (T2.TXD)
XFlywheel: Teensy Brain Control (Teensy_4.1.16-A2/RX4/SCL1), Ports (RN6.6 RN8.4)
XLeft: Teensy Brain Control (Teensy_4.1.35-TX8), Ports (RN1.6 RN2.4)
XMiddle: Teensy Brain Control (Teensy_4.1.38-A14/CS/IN1), Ports (RN3.6 RN4.4)
XRight: Teensy Brain Control (Teensy_4.1.41-A17/MISO1), Ports (RN5.6 RN7.4)